# Altium schematic sheet key_count.SchDoc
size A4
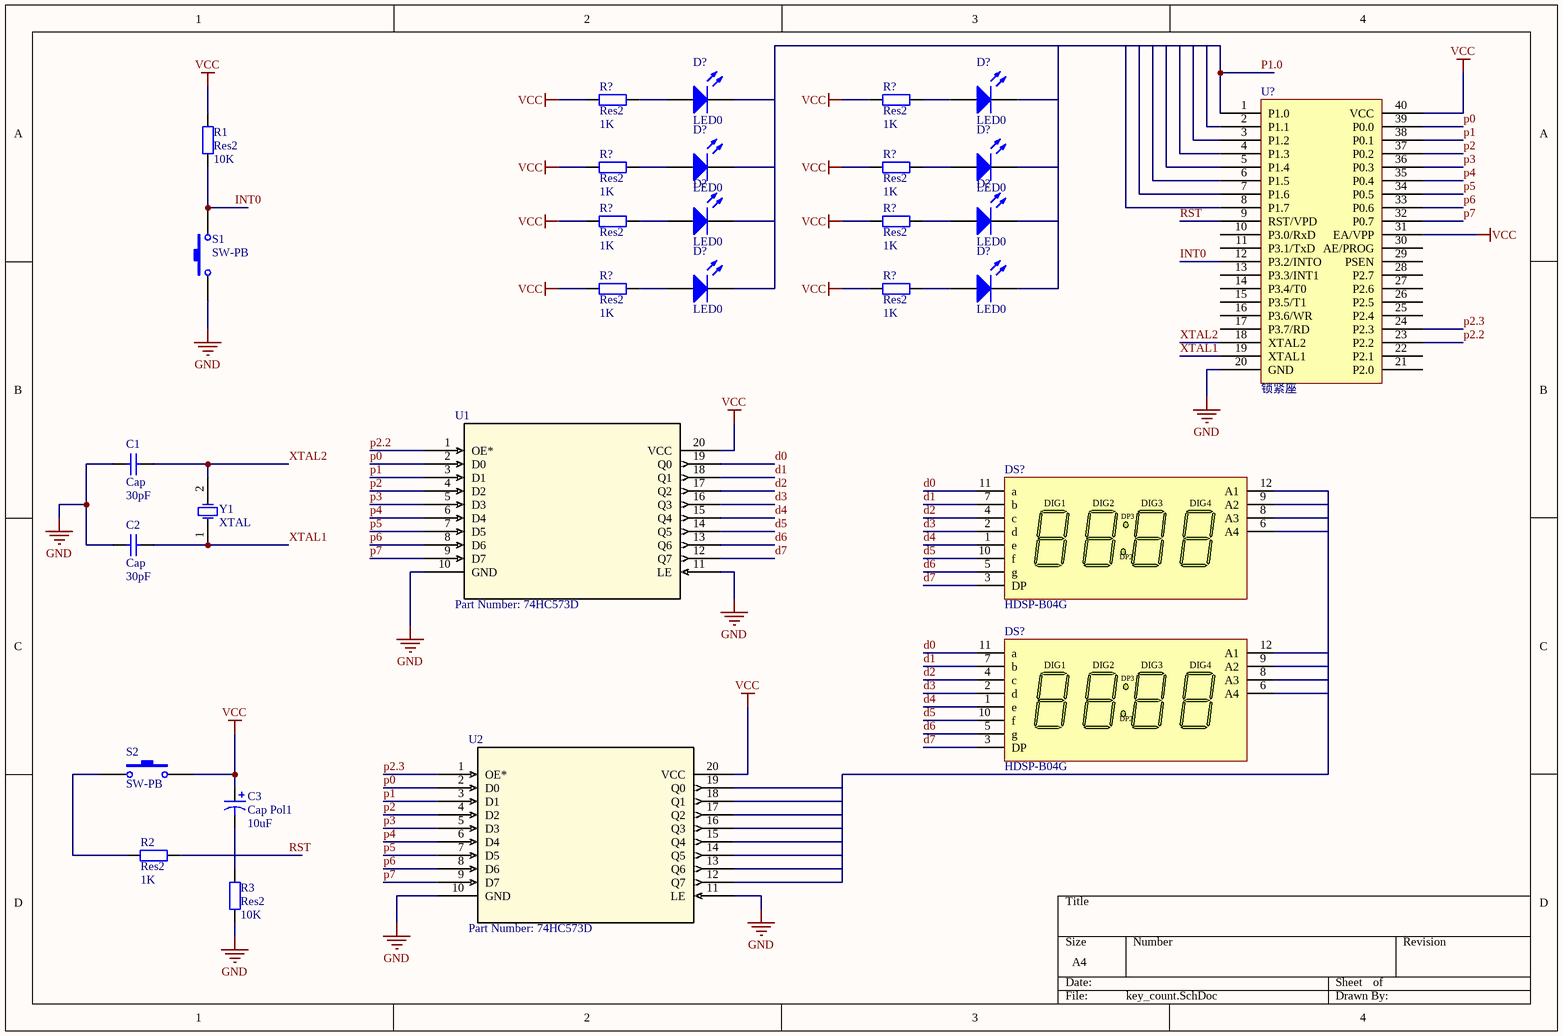
[diagram p0: key_count.SchDoc]

## Parts
(Parts that share a designator on the sheet are numbered #1, #2 ... from top to bottom, then left to right.)
C1  Cap  value 30pF  [RAD-0.3]
C2  Cap  value 30pF  [RAD-0.3]
C3  Cap Pol1  value 10uF  [RB7.6-15]
D?#1  LED0  [LED-0]
D?#2  LED0  [LED-0]
D?#3  LED0  [LED-0]
D?#4  LED0  [LED-0]
D?#5  LED0  [LED-0]
D?#6  LED0  [LED-0]
D?#7  LED0  [LED-0]
D?#8  LED0  [LED-0]
DS?#1  HDSP-B04G  [B-88]
DS?#2  HDSP-B04G  [B-88]
R1  Res2  value 10K  [AXIAL-0.4]
R2  Res2  value 1K  [AXIAL-0.4]
R3  Res2  value 10K  [AXIAL-0.4]
R?#1  Res2  value 1K  [AXIAL-0.4]
R?#2  Res2  value 1K  [AXIAL-0.4]
R?#3  Res2  value 1K  [AXIAL-0.4]
R?#4  Res2  value 1K  [AXIAL-0.4]
R?#5  Res2  value 1K  [AXIAL-0.4]
R?#6  Res2  value 1K  [AXIAL-0.4]
R?#7  Res2  value 1K  [AXIAL-0.4]
R?#8  Res2  value 1K  [AXIAL-0.4]
S1  SW-PB  [SPST-2]
S2  SW-PB  [SPST-2]
U1  Part Number: 74HC573D  [SOT163-1]
U2  Part Number: 74HC573D  [SOT163-1]
U?  锁紧座  [DIP_TP40-600]
Y1  XTAL  [R38]

## Nets
GND: C1.1 C2.1 R3.1 S1.1 U1.10(GND) U1.11(LE) U2.10(GND) U2.11(LE) U?.20(GND)
VCC: C3.1 R1.2 R?#1.2 R?#2.2 R?#3.2 R?#4.2 R?#5.2 R?#6.2 R?#7.2 R?#8.2 S2.2 U1.20(VCC) U2.20(VCC) U?.31(EA/VPP) U?.40(VCC)
d0: DS?#1.11(a) DS?#2.11(a) U1.19(Q0)
d1: DS?#1.7(b) DS?#2.7(b) U1.18(Q1)
d2: DS?#1.4(c) DS?#2.4(c) U1.17(Q2)
d3: DS?#1.2(d) DS?#2.2(d) U1.16(Q3)
d4: DS?#1.1(e) DS?#2.1(e) U1.15(Q4)
d5: DS?#1.10(f) DS?#2.10(f) U1.14(Q5)
d6: DS?#1.5(g) DS?#2.5(g) U1.13(Q6)
d7: DS?#1.3(DP) DS?#2.3(DP) U1.12(Q7)
INT0: R1.1 S1.2 U?.12(P3.2/INTO)
p0: U1.2(D0) U2.2(D0) U?.39(P0.0)
p1: U1.3(D1) U2.3(D1) U?.38(P0.1)
P1.0: U?.1(P1.0)
p2: U1.4(D2) U2.4(D2) U?.37(P0.2)
p2.2: U1.1(OE*) U?.23(P2.2)
p2.3: U2.1(OE*) U?.24(P2.3)
p3: U1.5(D3) U2.5(D3) U?.36(P0.3)
p4: U1.6(D4) U2.6(D4) U?.35(P0.4)
p5: U1.7(D5) U2.7(D5) U?.34(P0.5)
p6: U1.8(D6) U2.8(D6) U?.33(P0.6)
p7: U1.9(D7) U2.9(D7) U?.32(P0.7)
RST: R2.2 U?.9(RST/VPD)
XTAL1: C2.2 U?.19(XTAL1) Y1.1(OSC1)
XTAL2: C1.2 U?.18(XTAL2) Y1.2(OSC2)
NetC3_2: C3.2 R3.2
NetD?#1_1: D?#1.1(A) R?#1.1
NetD?#2_1: D?#2.1(A) R?#2.1
NetD?#3_1: D?#3.1(A) R?#3.1
NetD?#4_1: D?#4.1(A) R?#4.1
NetD?#5_1: D?#5.1(A) R?#5.1
NetD?#6_1: D?#6.1(A) R?#6.1
NetD?#7_1: D?#7.1(A) R?#7.1
NetD?#8_1: D?#8.1(A) R?#8.1
NetR2_1: R2.1 S2.1
NetU2_13: U2.13(Q6) U2.14(Q5)

Not connected (* = marked no-connect by the designer): D?#1 2(K); D?#2 2(K); D?#3 2(K); D?#4 2(K); D?#5 2(K); D?#6 2(K); D?#7 2(K); D?#8 2(K); DS?#1 6(A4) 8(A3) 9(A2) 12(A1); DS?#2 6(A4) 8(A3) 9(A2) 12(A1); U2 12(Q7) 15(Q4) 16(Q3) 17(Q2) 18(Q1) 19(Q0); U? 2(P1.1) 3(P1.2) 4(P1.3) 5(P1.4) 6(P1.5) 7(P1.6) 8(P1.7) 10(P3.0/RxD) 11(P3.1/TxD) 13(P3.3/INT1) 14(P3.4/T0) 15(P3.5/T1) 16(P3.6/WR) 17(P3.7/RD) 21(P2.0) 22(P2.1) 25(P2.4) 26(P2.5) 27(P2.6) 28(P2.7) 29(PSEN) 30(AE/PROG)

## Notes on the sheet
- (in symbol HDSP-B04G) DIG1; DIG2; DIG3; DIG4; DP3; DP2

## Library data of the parts
C1 C2 = Cap: Capacitor; Published: 8-Jun-2000; LatestRevisionDate: 17-Jul-2002; LatestRevisionNote: Re-released for DXP Platform.; PackageReference: RAD-0.3; Publisher: Altium Limited; PackageDescription: Radial Cap, Thru-Hole; 2 Leads; 0.3 in Pin Spacing
C3 = Cap Pol1: Polarized Capacitor (Radial); Published: 8-Jun-2000; LatestRevisionDate: 17-Jul-2002; LatestRevisionNote: Re-released for DXP Platform.; PackageReference: RB7.6-15; Publisher: Altium Limited; PackageDescription: Polarized Capacitor (Radial); 2 Leads
D?#1-D?#8 = LED0: Typical INFRARED GaAs LED; Published: 8-Jun-2000; LatestRevisionDate: 08-Jul-2005; LatestRevisionNote: Mech Layer 1 removed.; PackageReference: LED-0; Publisher: Altium Limited; PackageDescription: LED; 2 Leads
DS?#1 DS?#2 = HDSP-B04G: 14.22 mm Tinted Green, 88:88 4-Digit 7-Segment Display: CA, Gray Surface; LuminousIntensity: 2000 ucd (Minimum).; Published: 26-May-2004; LatestRevisionDate: 11-Oct-2004; LatestRevisionNote: Display outline superimposed on PCB Footprint.; DatasheetVersion: 23-Sep-2002; PackageVersion: 21-Aug-2001; PackageReference: B-88; Publisher: Altium Limited; PackageDescription: LED, 7-Segment Display, 14.22 mm, Four Digit, 88:88; 12 Leads; Row Space 15.24 mm; Pitch 2.54 mm; LED_Colour: Green; ComponentLink1Description: Manufacturer Link; ComponentLink1URL: http://www.agilent.com/; ComponentLink2Description: Datasheet; ComponentLink2URL: http://cp.literature.agilent.com/litweb/pdf/5988-7859EN.pdf
R1-R3 R?#1-R?#8 = Res2: Resistor; Published: 8-Jun-2000; LatestRevisionDate: 17-Jul-2002; LatestRevisionNote: Re-released for DXP Platform.; PackageReference: AXIAL-0.4; Publisher: Altium Limited; PackageDescription: Axial Device, Thru-Hole; 2 Leads; 0.4 in Pin Spacing
S1 S2 = SW-PB: Switch; Published: 24-Mar-1999; LatestRevisionDate: 17-Jul-2002; LatestRevisionNote: Re-released for DXP Platform.; PackageReference: SPST-2; Publisher: Altium Limited; PackageDescription: Switch; 2 Leads
U1 U2 = 74HC573D: No Description Available; Vendor: Nexperia; Manufacturer_Part_Number: 74HC573D; Copyright: Copyright (C) 2016 Accelerated Designs. All rights reserved; RefDes: RefDes; Type: DEV; Value: Value
U? = STC89C52
Y1 = XTAL: Crystal Oscillator; Published: 8-Jun-2000; LatestRevisionDate: 17-Jul-2002; LatestRevisionNote: Re-released for DXP Platform.; PackageReference: R38; Publisher: Altium Limited; PackageDescription: Crystal, Thru-Hole; 2 Leads; Body 3.1 x 8.2 mm (Dia.xH)